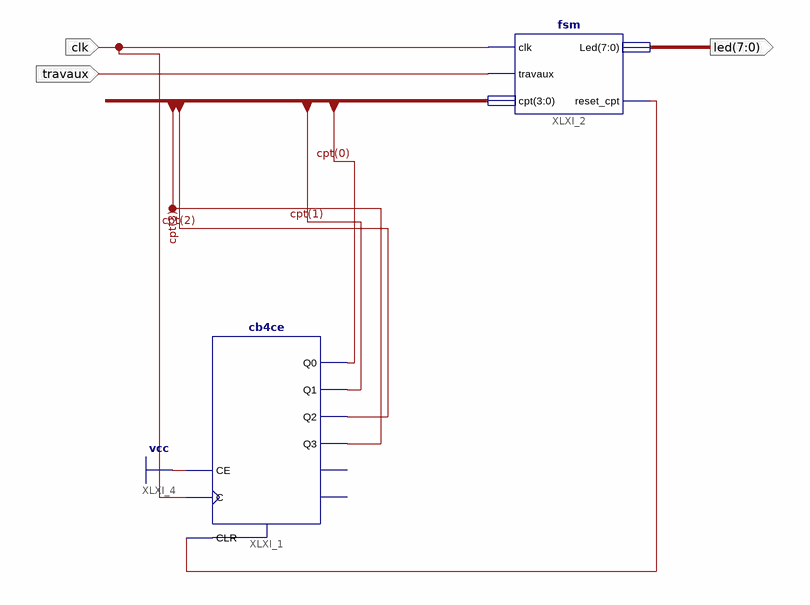
[diagram p0: schematic sheet 1]
// Xilinx ISE schematic controleur.sch (spartan6) as structural Verilog: 2 symbols, 3 ports
module controleur (
  input  travaux,
  input  clk,
  output [7:0] led
);

  wire XLXN_20;
  wire [3:0] cpt;

  cb4ce XLXI_1 (
    .C(clk), .CE(1'b1), .CLR(XLXN_20), .Q0(cpt[0]), .Q1(cpt[1]), .Q2(cpt[2]), .Q3(cpt[3]));  // open: CEO, TC
  fsm XLXI_2 (.clk(clk), .travaux(travaux), .cpt(cpt), .reset_cpt(XLXN_20), .Led(led));
endmodule
